# EasyEDA schematic Sheet_1.json
TITLE: 8 Bit ALU - CMP 1; REV: 1.0; Date: 2021-12-30; Sheet: 1/3; Drawn By: Koehler, Paul; Company: komed3
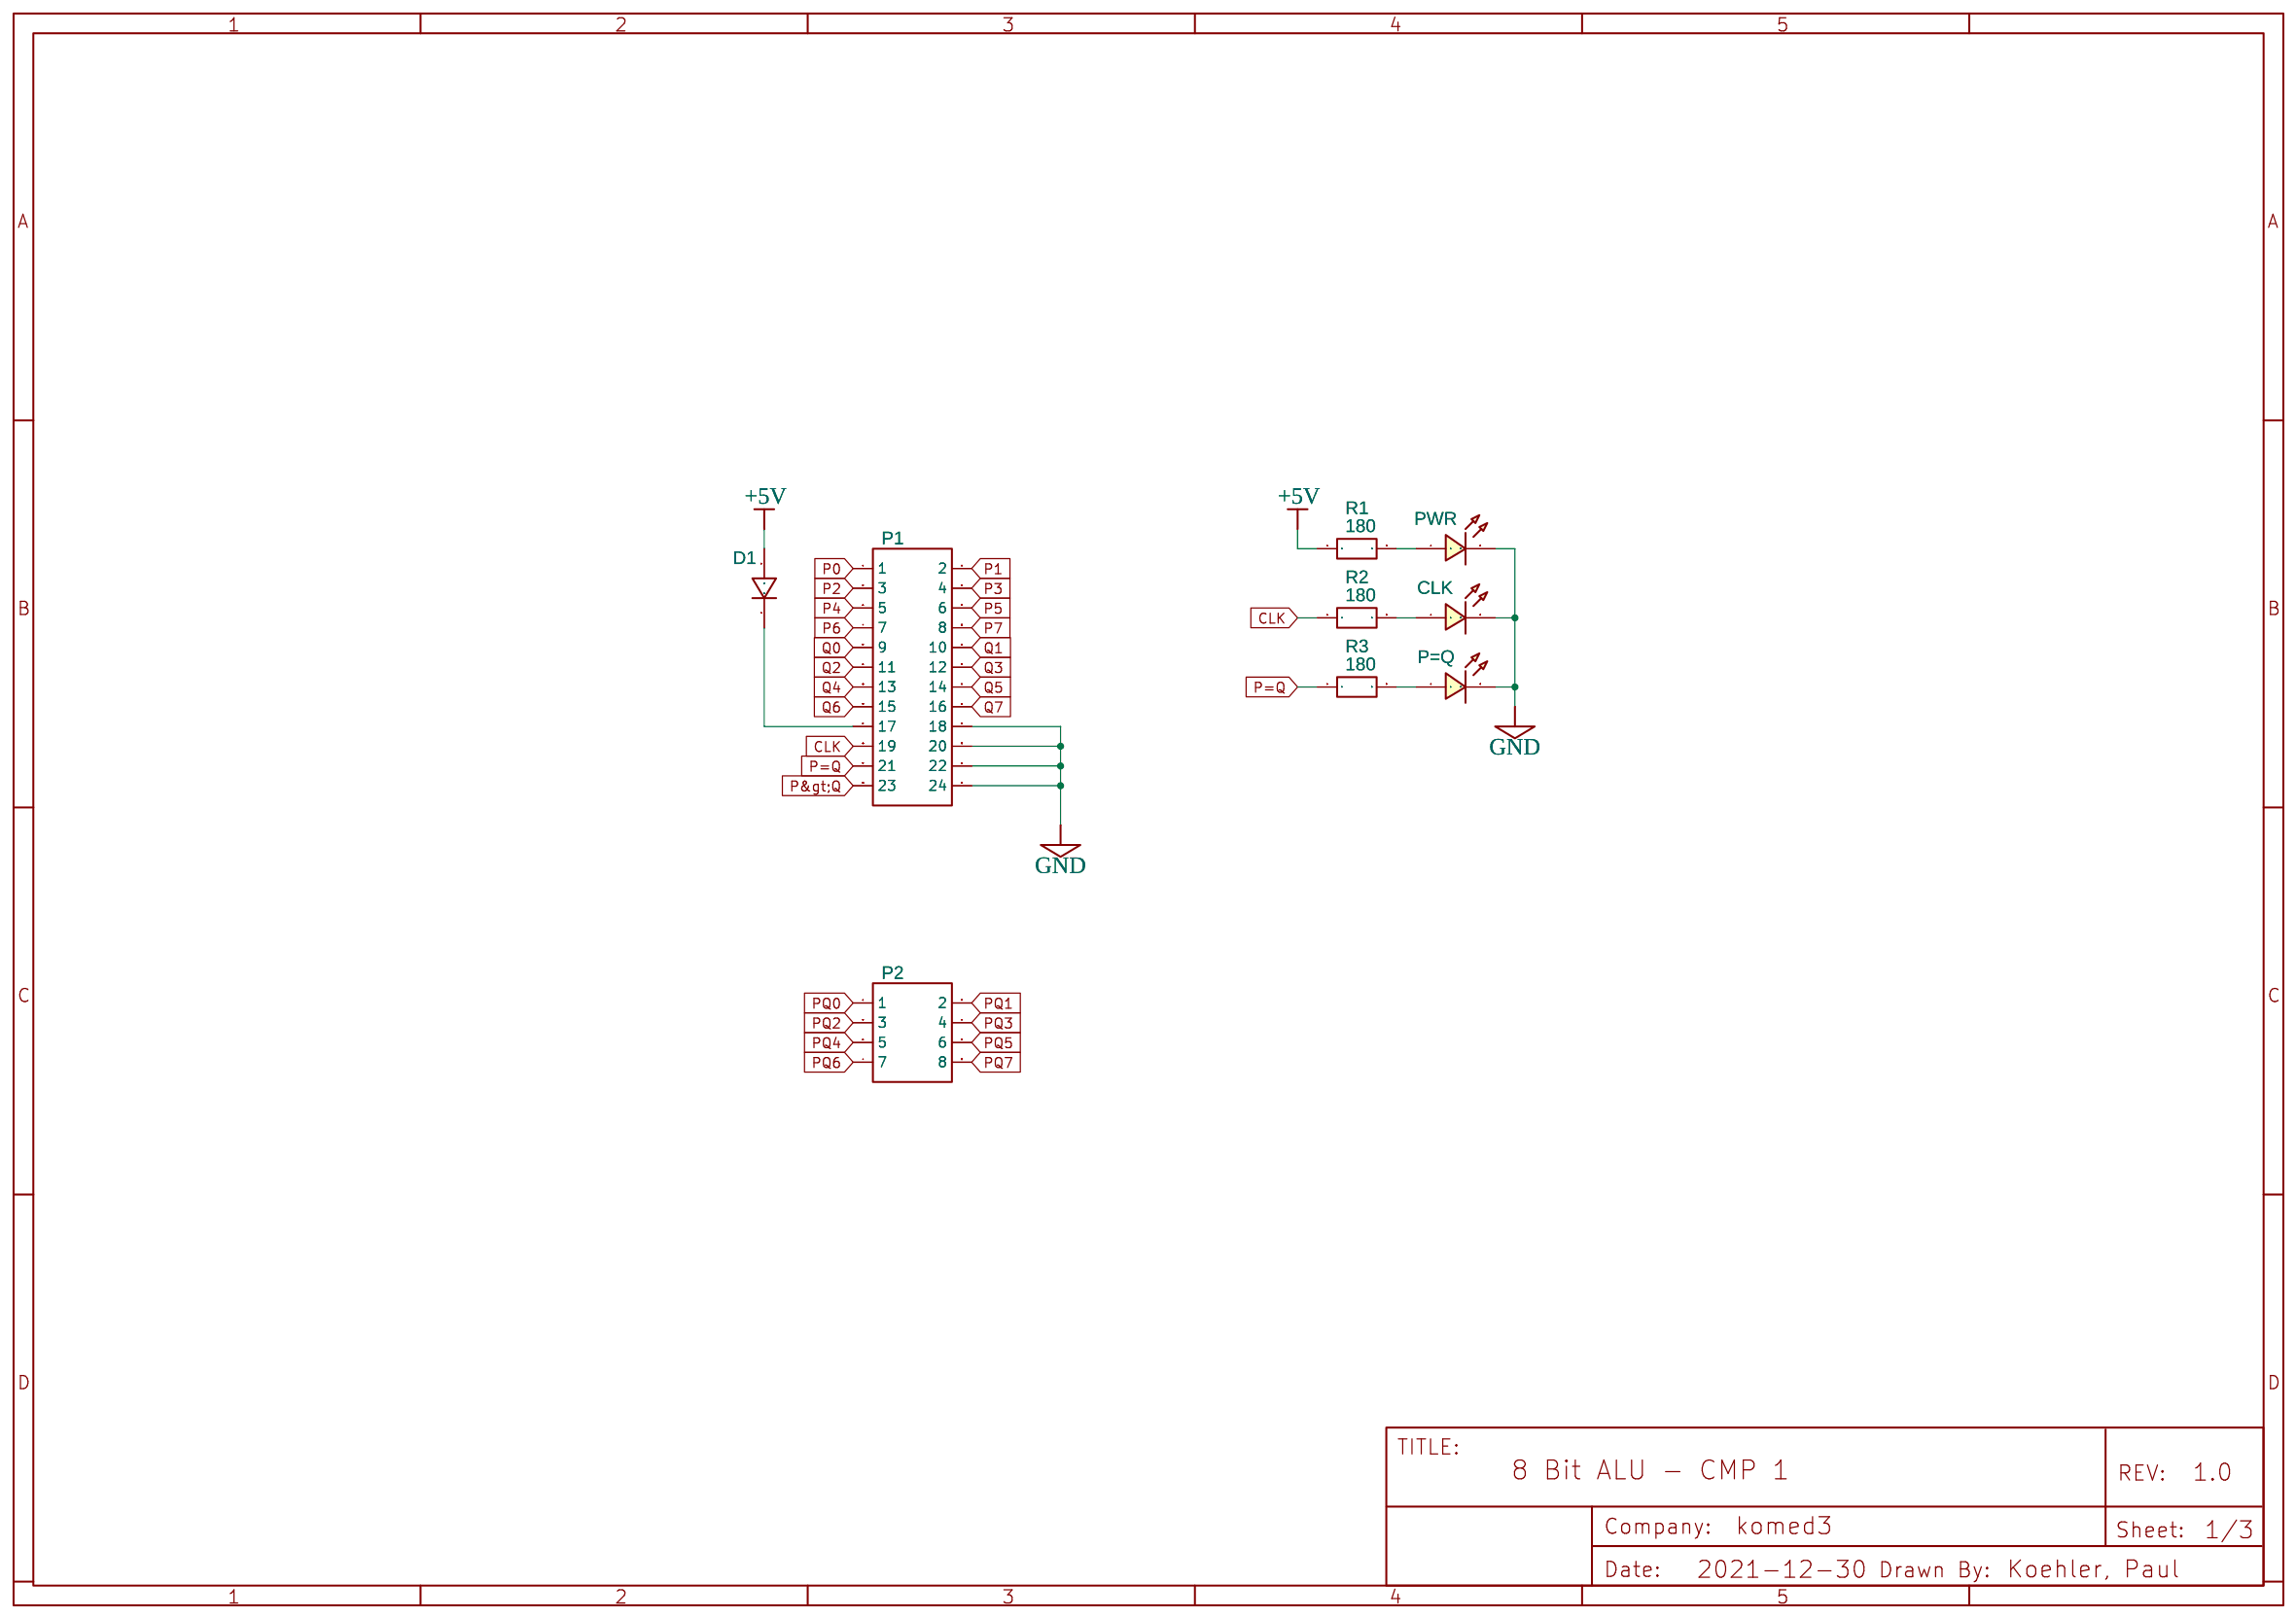
[diagram p0: schematic sheet]

## Parts
CLK  LED-TH-5mm_R  [LED-TH_BD5.0_RED]
D1  1N4007  [DO-41_BD2.4-L4.7-P8.70-D0.9-RD]
P1  HDR-IDC-2.54-2X12P  [IDC-TH_24P-P2.54-V-R2-C12-S2.54]
P2  HDR-IDC-2.54-2X4P  [IDC-TH_8P-P2.54-V-R2-C4-S2.54]
P=Q  LED-TH-5mm_R  [LED-TH_BD5.0_RED]
PWR  LED-TH-5mm_R  [LED-TH_BD5.0_RED]
R1  180  [R_AXIAL-0.3]
R2  180  [R_AXIAL-0.3]
R3  180  [R_AXIAL-0.3]

## Library data of the parts
CLK P=Q PWR = LED-TH-5mm_R: Manufacturer: EVERLIGHT(台湾亿光); Manufacturer Part: 333-2SURD/S530-A3; Supplier Part: C87271; Supplier: LCSC; Contributor: LCEDA_Lib
D1 = 1N4007: Supplier: LCSC; Manufacturer: SEMTECH; Supplier Part: C106903; Contributor: LCEDA_Lib
P1 = HDR-IDC-2.54-2X12P: Supplier: LCSC; Manufacturer: BOOMELE; Manufacturer Part: IDC Box 2X12 2.54MM; image: //image.lceda.cn/szlcsc/C9137.jpg; Supplier Part: C9137
P2 = HDR-IDC-2.54-2X4P: Supplier: LCSC; Manufacturer: BOOMELE; Manufacturer Part: IDC Box 2X4 2.54MM; image: //image.lceda.cn/szlcsc/C9135.jpg; Supplier Part: C9135
R1-R3 = R_AXIAL-0.3_EU: Contributor: LCEDA_Lib

## Nets
+5V: D1.2 R1.1
GND: CLK.2 P1.18 P1.20 P1.22 P1.24 P=Q.2 PWR.2
CLK: P1.19 R2.1
P0: P1.1
P1: P1.2
P2: P1.3
P3: P1.4
P4: P1.5
P5: P1.6
P6: P1.7
P7: P1.8
P>Q: P1.23
P=Q: P1.21 R3.1
PQ0: P2.1
PQ1: P2.2
PQ2: P2.3
PQ3: P2.4
PQ4: P2.5
PQ5: P2.6
PQ6: P2.7
PQ7: P2.8
Q0: P1.9
Q1: P1.10
Q2: P1.11
Q3: P1.12
Q4: P1.13
Q5: P1.14
Q6: P1.15
Q7: P1.16
Net-(CLK-1): CLK.1 R2.2
Net-(D1-1): D1.1 P1.17
Net-(P=Q-1): P=Q.1 R3.2
Net-(PWR-1): PWR.1 R1.2
